# Altium schematic sheet con-right-top.SchDoc: CS - Right Top
size Letter; CheckedBy: J. Brinton; CompanyName: Signal Laboratories, Inc.; DrawnBy: J. Brinton; Engineer: J. Brinton; Address1: 3479 Edison Way; Address2: Menlo Park CA 94025; Address3: +1 (877) 778-8435; Address4: siglabs.com; Revision: 3; SheetNumber: 34; SheetTotal: 47
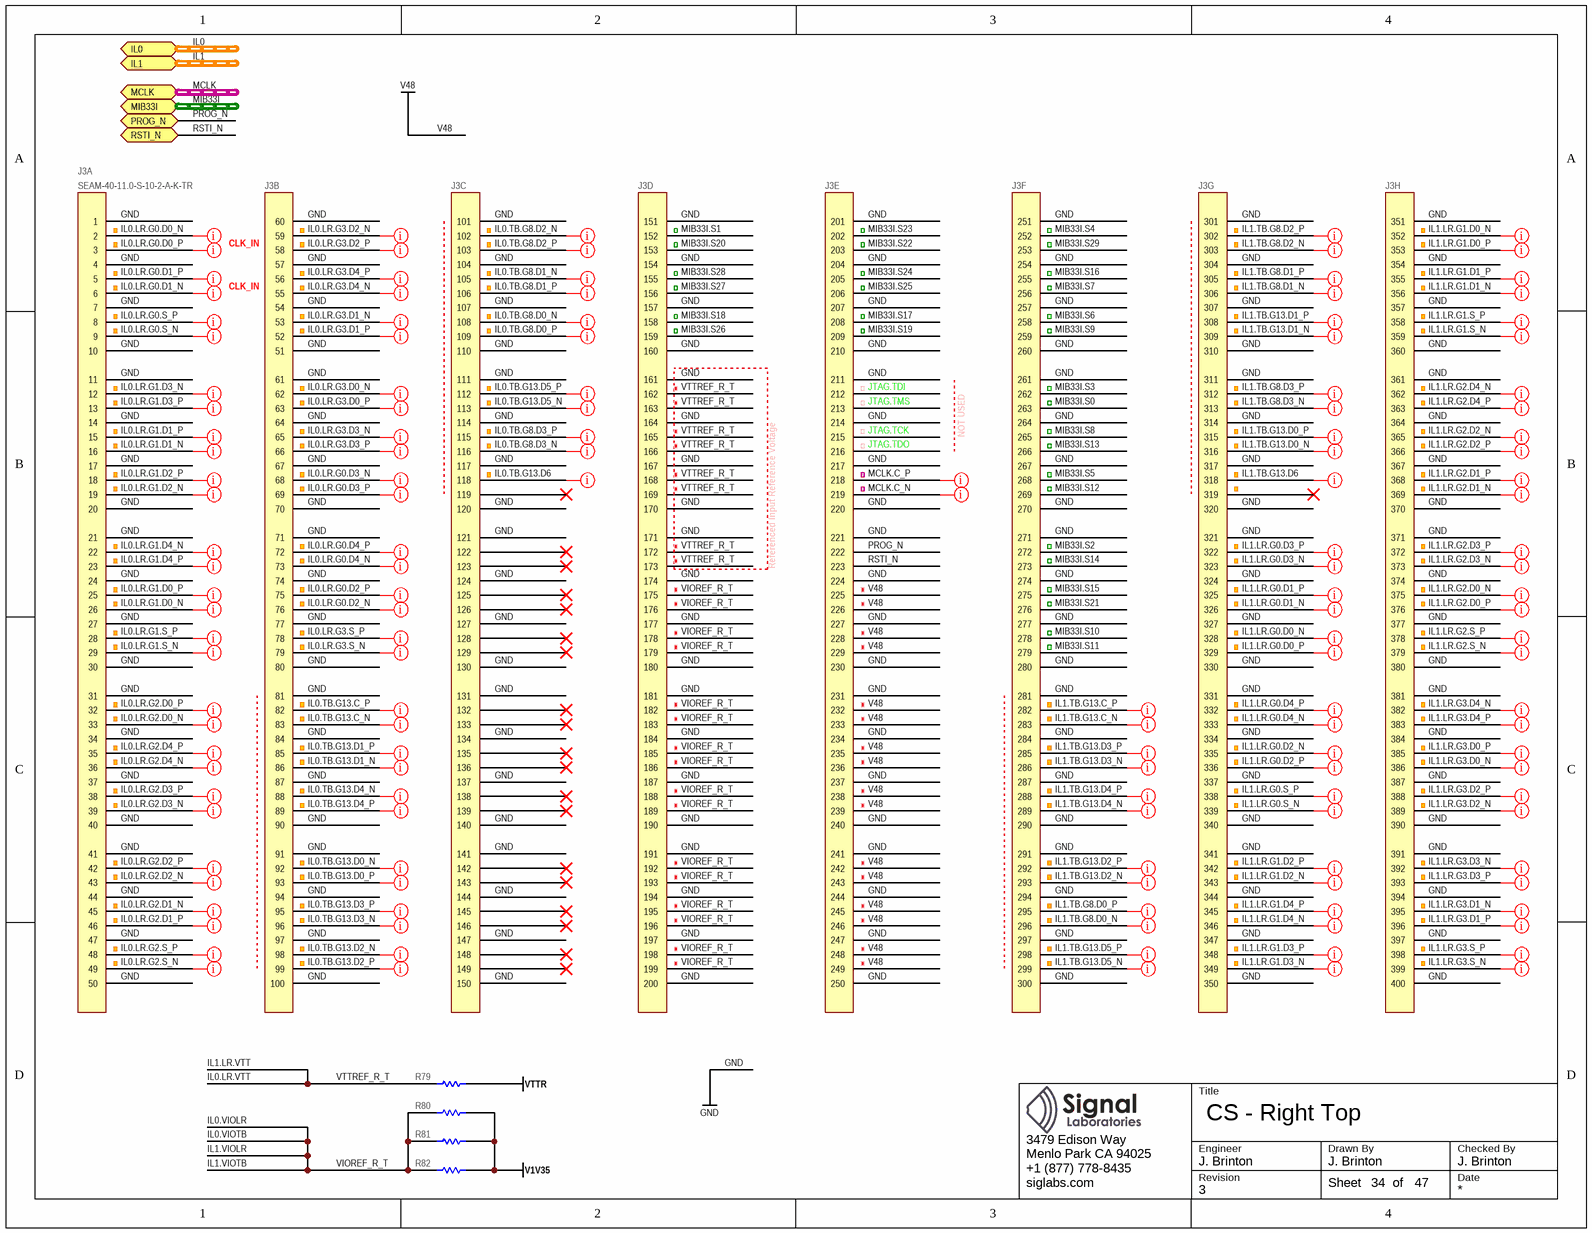
[diagram p0: con-right-top.SchDoc]

## Parts
J3  SEAM-40-11.0-S-10-2-A-K-TR  [SEAM-40-11.0-S-10-2-A-K-TR]  (parts A,B,C,D,E,F,G,H of 8)
R79  SOLDER_LINK  [SOLDERLINK0603X26N]  (value not drawn)  (no BOM)
R80  SOLDER_LINK  [SOLDERLINK0603X26N]  (value not drawn)  (no BOM)
R81  SOLDER_LINK  [SOLDERLINK0603X26N]  (value not drawn)  (no BOM)
R82  SOLDER_LINK  [SOLDERLINK0603X26N]  (value not drawn)  (no BOM)

## Ports
IL0 (harness IL), IL1 (harness IL), MCLK (harness LVPECL33), MIB33I (harness MIB), PROG_N (bidir), RSTI_N (bidir)

## Nets
GND: J3.1 J3.4 J3.7 J3.10 J3.11 J3.14 J3.17 J3.20 J3.21 J3.24 J3.27 J3.30 J3.31 J3.34 J3.37 J3.40 J3.41 J3.44 J3.47 J3.50 J3.51 J3.54 J3.57 J3.60 J3.61 J3.64 J3.67 J3.70 J3.71 J3.74 J3.77 J3.80 J3.81 J3.84 J3.87 J3.90 J3.91 J3.94 J3.97 J3.100 J3.101 J3.104 J3.107 J3.110 J3.111 J3.114 J3.117 J3.120 J3.121 J3.124 J3.127 J3.130 J3.131 J3.134 J3.137 J3.140 J3.141 J3.144 J3.147 J3.150 J3.151 J3.154 J3.157 J3.160 J3.161 J3.164 J3.167 J3.170 J3.171 J3.174 J3.177 J3.180 J3.181 J3.184 J3.187 J3.190 J3.191 J3.194 J3.197 J3.200 J3.201 J3.204 J3.207 J3.210 J3.211 J3.214 J3.217 J3.220 J3.221 J3.224 J3.227 J3.230 J3.231 J3.234 J3.237 J3.240 J3.241 J3.244 J3.247 J3.250 J3.251 J3.254 J3.257 J3.260 J3.261 J3.264 J3.267 J3.270 J3.271 J3.274 J3.277 J3.280 J3.281 J3.284 J3.287 J3.290 J3.291 J3.294 J3.297 J3.300 J3.301 J3.304 J3.307 J3.310 J3.311 J3.314 J3.317 J3.320 J3.321 J3.324 J3.327 J3.330 J3.331 J3.334 J3.337 J3.340 J3.341 J3.344 J3.347 J3.350 J3.351 J3.354 J3.357 J3.360 J3.361 J3.364 J3.367 J3.370 J3.371 J3.374 J3.377 J3.380 J3.381 J3.384 J3.387 J3.390 J3.391 J3.394 J3.397 J3.400
V1V35: R80.1 R81.1 R82.1
V48: J3.225 J3.226 J3.228 J3.229 J3.232 J3.233 J3.235 J3.236 J3.238 J3.239 J3.242 J3.243 J3.245 J3.246 J3.248 J3.249
VTTR: R79.1
IL0.LR.G0.D0_N: J3.2
IL0.LR.G0.D0_P: J3.3
IL0.LR.G0.D1_N: J3.6
IL0.LR.G0.D1_P: J3.5
IL0.LR.G0.D2_N: J3.76
IL0.LR.G0.D2_P: J3.75
IL0.LR.G0.D3_N: J3.68
IL0.LR.G0.D3_P: J3.69
IL0.LR.G0.D4_N: J3.73
IL0.LR.G0.D4_P: J3.72
IL0.LR.G0.S_N: J3.9
IL0.LR.G0.S_P: J3.8
IL0.LR.G1.D0_N: J3.26
IL0.LR.G1.D0_P: J3.25
IL0.LR.G1.D1_N: J3.16
IL0.LR.G1.D1_P: J3.15
IL0.LR.G1.D2_N: J3.19
IL0.LR.G1.D2_P: J3.18
IL0.LR.G1.D3_N: J3.12
IL0.LR.G1.D3_P: J3.13
IL0.LR.G1.D4_N: J3.22
IL0.LR.G1.D4_P: J3.23
IL0.LR.G1.S_N: J3.29
IL0.LR.G1.S_P: J3.28
IL0.LR.G2.D0_N: J3.33
IL0.LR.G2.D0_P: J3.32
IL0.LR.G2.D1_N: J3.45
IL0.LR.G2.D1_P: J3.46
IL0.LR.G2.D2_N: J3.43
IL0.LR.G2.D2_P: J3.42
IL0.LR.G2.D3_N: J3.39
IL0.LR.G2.D3_P: J3.38
IL0.LR.G2.D4_N: J3.36
IL0.LR.G2.D4_P: J3.35
IL0.LR.G2.S_N: J3.49
IL0.LR.G2.S_P: J3.48
IL0.LR.G3.D0_N: J3.62
IL0.LR.G3.D0_P: J3.63
IL0.LR.G3.D1_N: J3.53
IL0.LR.G3.D1_P: J3.52
IL0.LR.G3.D2_N: J3.59
IL0.LR.G3.D2_P: J3.58
IL0.LR.G3.D3_N: J3.65
IL0.LR.G3.D3_P: J3.66
IL0.LR.G3.D4_N: J3.55
IL0.LR.G3.D4_P: J3.56
IL0.LR.G3.S_N: J3.79
IL0.LR.G3.S_P: J3.78
IL0.LR.VTT: J3.162 J3.163 J3.165 J3.166 J3.168 J3.169 J3.172 J3.173 R79.2  [also labelled IL1.LR.VTT, VTTREF_R_T]
IL0.TB.G8.D0_N: J3.108
IL0.TB.G8.D0_P: J3.109
IL0.TB.G8.D1_N: J3.105
IL0.TB.G8.D1_P: J3.106
IL0.TB.G8.D2_N: J3.102
IL0.TB.G8.D2_P: J3.103
IL0.TB.G8.D3_N: J3.116
IL0.TB.G8.D3_P: J3.115
IL0.TB.G13.C_N: J3.83
IL0.TB.G13.C_P: J3.82
IL0.TB.G13.D0_N: J3.92
IL0.TB.G13.D0_P: J3.93
IL0.TB.G13.D1_N: J3.86
IL0.TB.G13.D1_P: J3.85
IL0.TB.G13.D2_N: J3.98
IL0.TB.G13.D2_P: J3.99
IL0.TB.G13.D3_N: J3.96
IL0.TB.G13.D3_P: J3.95
IL0.TB.G13.D4_N: J3.88
IL0.TB.G13.D4_P: J3.89
IL0.TB.G13.D5_N: J3.113
IL0.TB.G13.D5_P: J3.112
IL0.TB.G13.D6: J3.118
IL0.VIOLR: J3.175 J3.176 J3.178 J3.179 J3.182 J3.183 J3.185 J3.186 J3.188 J3.189 J3.192 J3.193 J3.195 J3.196 J3.198 J3.199 R80.2 R81.2 R82.2  [also labelled IL0.VIOTB, IL1.VIOLR, IL1.VIOTB, VIOREF_R_T]
IL1.LR.G0.D0_N: J3.328
IL1.LR.G0.D0_P: J3.329
IL1.LR.G0.D1_N: J3.326
IL1.LR.G0.D1_P: J3.325
IL1.LR.G0.D2_N: J3.335
IL1.LR.G0.D2_P: J3.336
IL1.LR.G0.D3_N: J3.323
IL1.LR.G0.D3_P: J3.322
IL1.LR.G0.D4_N: J3.333
IL1.LR.G0.D4_P: J3.332
IL1.LR.G0.S_N: J3.339
IL1.LR.G0.S_P: J3.338
IL1.LR.G1.D0_N: J3.352
IL1.LR.G1.D0_P: J3.353
IL1.LR.G1.D1_N: J3.356
IL1.LR.G1.D1_P: J3.355
IL1.LR.G1.D2_N: J3.343
IL1.LR.G1.D2_P: J3.342
IL1.LR.G1.D3_N: J3.349
IL1.LR.G1.D3_P: J3.348
IL1.LR.G1.D4_N: J3.346
IL1.LR.G1.D4_P: J3.345
IL1.LR.G1.S_N: J3.359
IL1.LR.G1.S_P: J3.358
IL1.LR.G2.D0_N: J3.375
IL1.LR.G2.D0_P: J3.376
IL1.LR.G2.D1_N: J3.369
IL1.LR.G2.D1_P: J3.368
IL1.LR.G2.D2_N: J3.365
IL1.LR.G2.D2_P: J3.366
IL1.LR.G2.D3_N: J3.373
IL1.LR.G2.D3_P: J3.372
IL1.LR.G2.D4_N: J3.362
IL1.LR.G2.D4_P: J3.363
IL1.LR.G2.S_N: J3.379
IL1.LR.G2.S_P: J3.378
IL1.LR.G3.D0_N: J3.386
IL1.LR.G3.D0_P: J3.385
IL1.LR.G3.D1_N: J3.395
IL1.LR.G3.D1_P: J3.396
IL1.LR.G3.D2_N: J3.389
IL1.LR.G3.D2_P: J3.388
IL1.LR.G3.D3_N: J3.392
IL1.LR.G3.D3_P: J3.393
IL1.LR.G3.D4_N: J3.382
IL1.LR.G3.D4_P: J3.383
IL1.LR.G3.S_N: J3.399
IL1.LR.G3.S_P: J3.398
IL1.TB.G8.D0_N: J3.296
IL1.TB.G8.D0_P: J3.295
IL1.TB.G8.D1_N: J3.306
IL1.TB.G8.D1_P: J3.305
IL1.TB.G8.D2_N: J3.303
IL1.TB.G8.D2_P: J3.302
IL1.TB.G8.D3_N: J3.313
IL1.TB.G8.D3_P: J3.312
IL1.TB.G13.C_N: J3.283
IL1.TB.G13.C_P: J3.282
IL1.TB.G13.D0_N: J3.316
IL1.TB.G13.D0_P: J3.315
IL1.TB.G13.D1_N: J3.309
IL1.TB.G13.D1_P: J3.308
IL1.TB.G13.D2_N: J3.293
IL1.TB.G13.D2_P: J3.292
IL1.TB.G13.D3_N: J3.286
IL1.TB.G13.D3_P: J3.285
IL1.TB.G13.D4_N: J3.289
IL1.TB.G13.D4_P: J3.288
IL1.TB.G13.D5_N: J3.299
IL1.TB.G13.D5_P: J3.298
IL1.TB.G13.D6: J3.318
MCLK.C_N: J3.219
MCLK.C_P: J3.218
MIB33I.S0: J3.263
MIB33I.S1: J3.152
MIB33I.S2: J3.272
MIB33I.S3: J3.262
MIB33I.S4: J3.252
MIB33I.S5: J3.268
MIB33I.S6: J3.258
MIB33I.S7: J3.256
MIB33I.S8: J3.265
MIB33I.S9: J3.259
MIB33I.S10: J3.278
MIB33I.S11: J3.279
MIB33I.S12: J3.269
MIB33I.S13: J3.266
MIB33I.S14: J3.273
MIB33I.S15: J3.275
MIB33I.S16: J3.255
MIB33I.S17: J3.208
MIB33I.S18: J3.158
MIB33I.S19: J3.209
MIB33I.S20: J3.153
MIB33I.S21: J3.276
MIB33I.S22: J3.203
MIB33I.S23: J3.202
MIB33I.S24: J3.205
MIB33I.S25: J3.206
MIB33I.S26: J3.159
MIB33I.S27: J3.156
MIB33I.S28: J3.155
MIB33I.S29: J3.253
PROG_N: J3.222 ; port PROG_N
RSTI_N: J3.223 ; port RSTI_N

Not connected (* = marked no-connect by the designer): J3 119* 122* 123* 125* 126* 128* 129* 132* 133* 135* 136* 138* 139* 142* 143* 145* 146* 148* 149* 212 213 215 216 319*

## Buses and harness runs
harness IL0 = port IL0
harness IL1 = port IL1
harness MCLK = port MCLK
harness MIB33I = port MIB33I

## Layout directives
net class z50: IL0.TB.G13.D6, IL1.TB.G13.D6
net class z50; differential pair; net class loose: IL0.LR.G0.D0_N, IL0.LR.G0.D0_P, IL0.LR.G0.D1_N, IL0.LR.G0.D1_P, IL0.LR.G0.D2_N, IL0.LR.G0.D2_P, IL0.LR.G0.D3_N, IL0.LR.G0.D3_P, IL0.LR.G0.D4_N, IL0.LR.G0.D4_P, IL0.LR.G0.S_N, IL0.LR.G0.S_P, IL0.LR.G1.D0_N, IL0.LR.G1.D0_P, IL0.LR.G1.D1_N, IL0.LR.G1.D1_P, IL0.LR.G1.D2_N, IL0.LR.G1.D2_P, IL0.LR.G1.D3_N, IL0.LR.G1.D3_P, IL0.LR.G1.D4_N, IL0.LR.G1.D4_P, IL0.LR.G1.S_N, IL0.LR.G1.S_P, IL0.LR.G2.D0_N, IL0.LR.G2.D0_P, IL0.LR.G2.D1_N, IL0.LR.G2.D1_P, IL0.LR.G2.D2_N, IL0.LR.G2.D2_P, IL0.LR.G2.D3_N, IL0.LR.G2.D3_P, IL0.LR.G2.D4_N, IL0.LR.G2.D4_P, IL0.LR.G2.S_N, IL0.LR.G2.S_P, IL0.LR.G3.D0_N, IL0.LR.G3.D0_P, IL0.LR.G3.D1_N, IL0.LR.G3.D1_P, IL0.LR.G3.D2_N, IL0.LR.G3.D2_P, IL0.LR.G3.D3_N, IL0.LR.G3.D3_P, IL0.LR.G3.D4_N, IL0.LR.G3.D4_P, IL0.LR.G3.S_N, IL0.LR.G3.S_P, IL0.TB.G8.D0_N, IL0.TB.G8.D0_P, IL0.TB.G8.D1_N, IL0.TB.G8.D1_P, IL0.TB.G8.D2_N, IL0.TB.G8.D2_P, IL0.TB.G8.D3_N, IL0.TB.G8.D3_P, IL0.TB.G13.C_N, IL0.TB.G13.C_P, IL0.TB.G13.D0_N, IL0.TB.G13.D0_P, IL0.TB.G13.D1_N, IL0.TB.G13.D1_P, IL0.TB.G13.D2_N, IL0.TB.G13.D2_P, IL0.TB.G13.D3_N, IL0.TB.G13.D3_P, IL0.TB.G13.D4_N, IL0.TB.G13.D4_P, IL0.TB.G13.D5_N, IL0.TB.G13.D5_P, IL1.LR.G0.D0_N, IL1.LR.G0.D0_P, IL1.LR.G0.D1_N, IL1.LR.G0.D1_P, IL1.LR.G0.D2_N, IL1.LR.G0.D2_P, IL1.LR.G0.D3_N, IL1.LR.G0.D3_P, IL1.LR.G0.D4_N, IL1.LR.G0.D4_P, IL1.LR.G0.S_N, IL1.LR.G0.S_P, IL1.LR.G1.D0_N, IL1.LR.G1.D0_P, IL1.LR.G1.D1_N, IL1.LR.G1.D1_P, IL1.LR.G1.D2_N, IL1.LR.G1.D2_P, IL1.LR.G1.D3_N, IL1.LR.G1.D3_P, IL1.LR.G1.D4_N, IL1.LR.G1.D4_P, IL1.LR.G1.S_N, IL1.LR.G1.S_P, IL1.LR.G2.D0_N, IL1.LR.G2.D0_P, IL1.LR.G2.D1_N, IL1.LR.G2.D1_P, IL1.LR.G2.D2_N, IL1.LR.G2.D2_P, IL1.LR.G2.D3_N, IL1.LR.G2.D3_P, IL1.LR.G2.D4_N, IL1.LR.G2.D4_P, IL1.LR.G2.S_N, IL1.LR.G2.S_P, IL1.LR.G3.D0_N, IL1.LR.G3.D0_P, IL1.LR.G3.D1_N, IL1.LR.G3.D1_P, IL1.LR.G3.D2_N, IL1.LR.G3.D2_P, IL1.LR.G3.D3_N, IL1.LR.G3.D3_P, IL1.LR.G3.D4_N, IL1.LR.G3.D4_P, IL1.LR.G3.S_N, IL1.LR.G3.S_P, IL1.TB.G8.D0_N, IL1.TB.G8.D0_P, IL1.TB.G8.D1_N, IL1.TB.G8.D1_P, IL1.TB.G8.D2_N, IL1.TB.G8.D2_P, IL1.TB.G8.D3_N, IL1.TB.G8.D3_P, IL1.TB.G13.C_N, IL1.TB.G13.C_P, IL1.TB.G13.D0_N, IL1.TB.G13.D0_P, IL1.TB.G13.D1_N, IL1.TB.G13.D1_P, IL1.TB.G13.D2_N, IL1.TB.G13.D2_P, IL1.TB.G13.D3_N, IL1.TB.G13.D3_P, IL1.TB.G13.D4_N, IL1.TB.G13.D4_P, IL1.TB.G13.D5_N, IL1.TB.G13.D5_P
net class z50; differential pair; net class tight: MCLK.C_N, MCLK.C_P

## Notes on the sheet
- (near J3) CLK_IN
- (near J3) JTAG.TDI
- (near J3) JTAG.TCK
- (near J3) JTAG.TDO
- (near J3) JTAG.TMS
- NOT USED
- Referenced Input Reference Voltage
- Title
- Engineer
- Revision
- Drawn By
- Checked By
- Date
- Sheet
- of

## Library data of the parts
J3 = SEAM-40-11.0-S-10-2-A-K-TR: Terminal Array Assembly, Surface Mount, 0.050" Pitch, 400 Pins; Manufacturer: Samtec; Manufacturer P/N: SEAM-40-11.0-S-10-2-A-K-TR
R79-R82 = RES: Solder Link; Manufacturer P/N: *; Manufacturer: *